# EAGLE design Qwiic_Adaptive_Switch_Input1.1 (EAGLE 9.6.2)
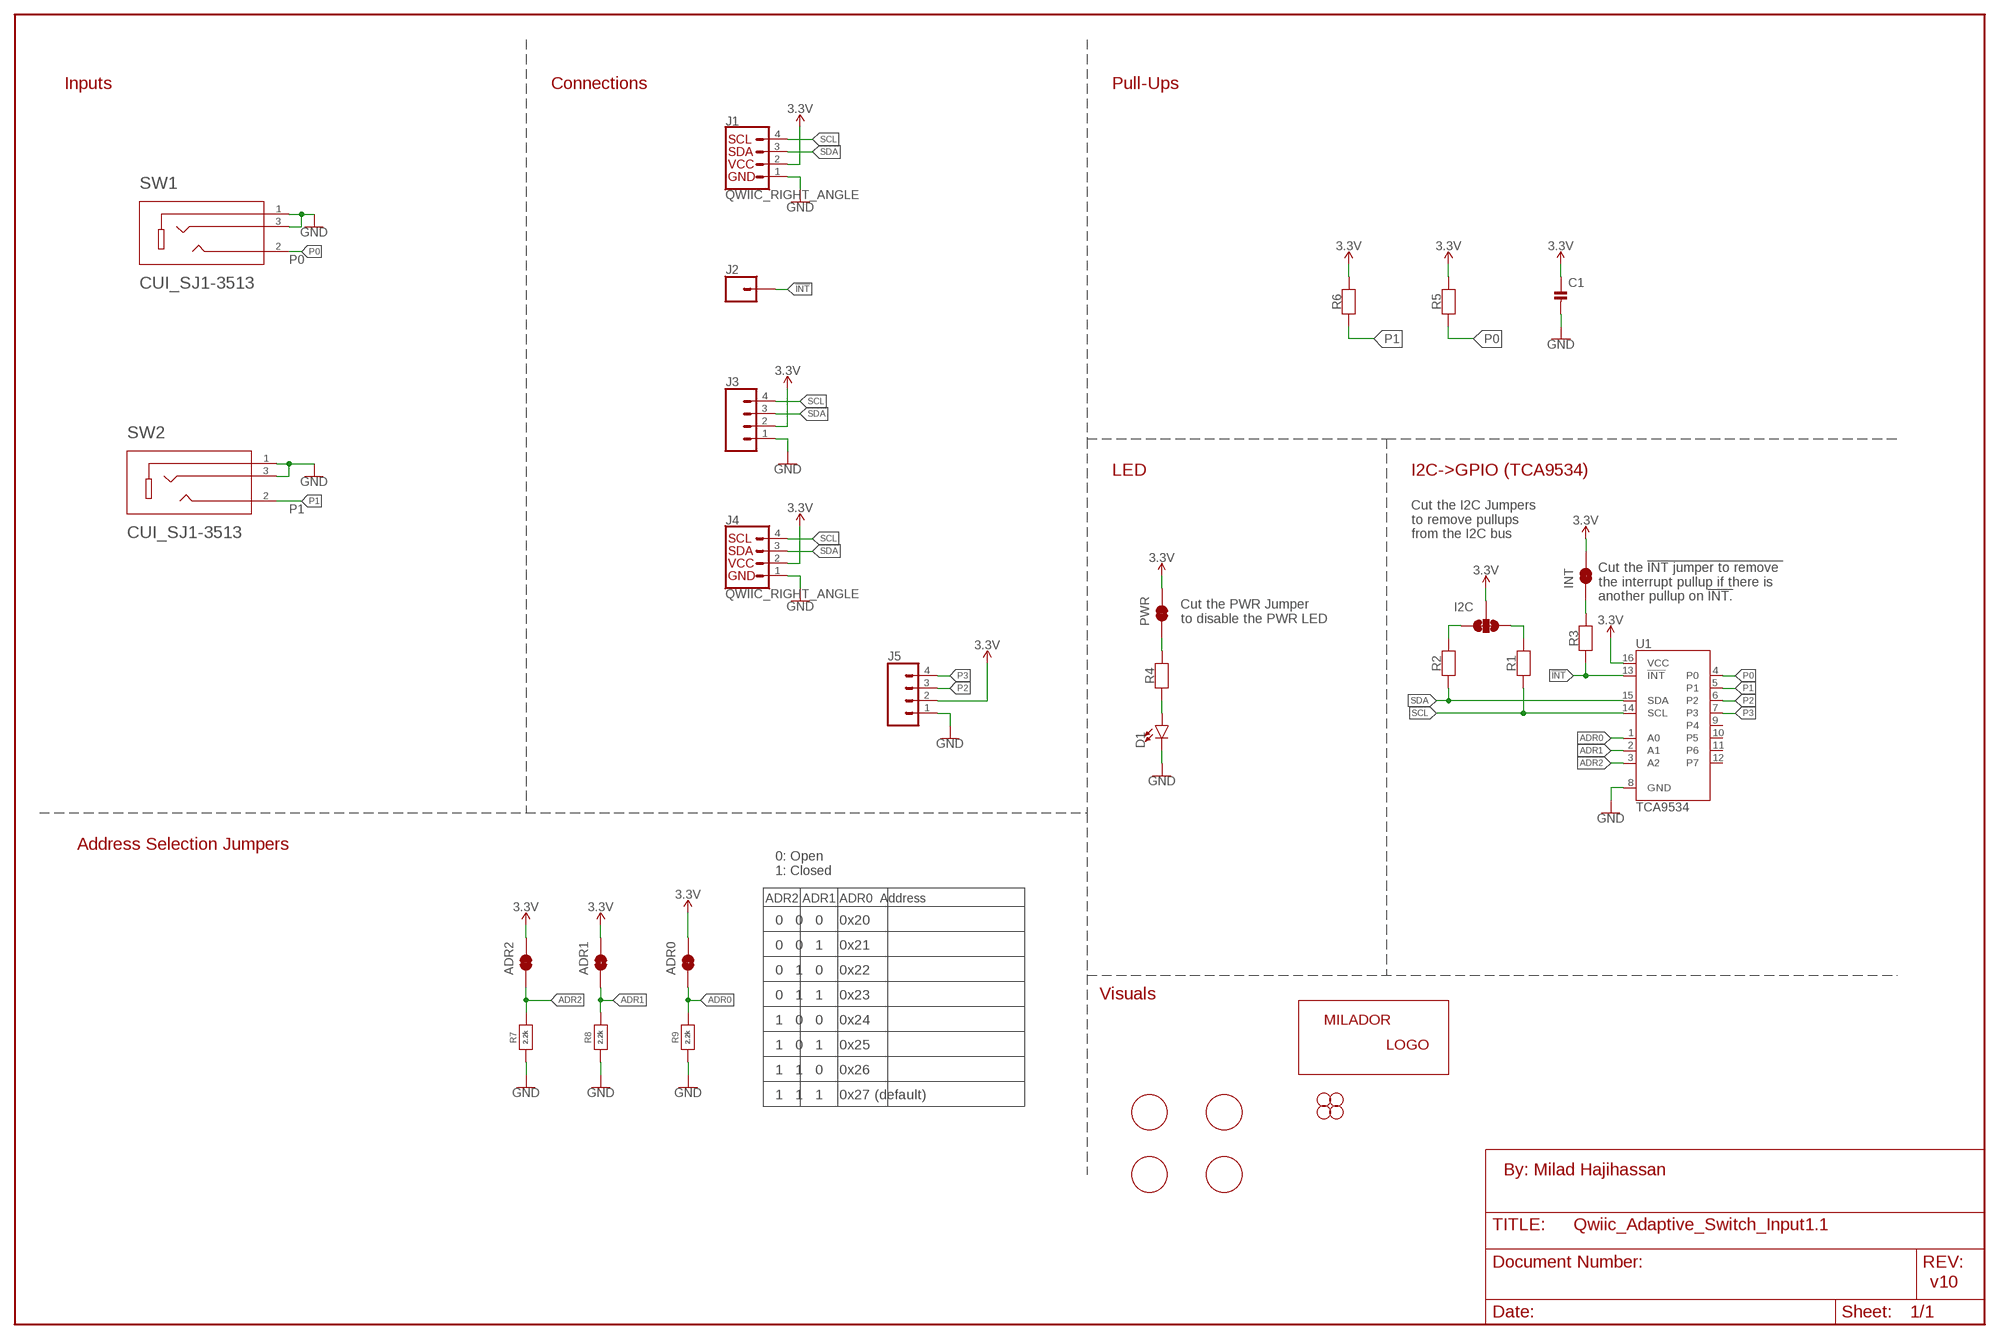
[diagram p0: schematic, sheet 1]

## Parts
ADR0  JUMPERS-SMT_2_NC_TRACE_SILK  [JUMPERS_SMT-JUMPER_2_NC_TRACE_SILK]
ADR1  JUMPERS-SMT_2_NC_TRACE_SILK  [JUMPERS_SMT-JUMPER_2_NC_TRACE_SILK]
ADR2  JUMPERS-SMT_2_NC_TRACE_SILK  [JUMPERS_SMT-JUMPER_2_NC_TRACE_SILK]
C1  0.1uF  CAP_CERAMIC-0805-MP  [0805-MP]
D1  RED  LED0805_NOOUTLINE  [CHIPLED_0805_NOOUTLINE]
H1  STAND-OFF-3.3  [STAND-OFF-3.3]
H2  STAND-OFF-3.3  [STAND-OFF-3.3]
I2C  JUMPERS_JUMPER-SMT_3_2-NC_TRACE_SILK  [JUMPERS_SMT-JUMPER_3_2-NC_TRACE_SILK]
INT  JUMPERS-SMT_2_NC_TRACE_SILK  [JUMPERS_SMT-JUMPER_2_NC_TRACE_SILK]
J1  QWIIC_RIGHT_ANGLE  QWIIC_CONNECTORSJS-1MM  [CONNECTORS_JST04_1MM_RA]
J2  CONNECTORS_CONN_01PTH_NO_SILK_YES_STOP  [CONNECTORS_1X01_NO_SILK]
J3  CONNECTORS_CONN_041X04_NO_SILK  [CONNECTORS_1X04_NO_SILK]
J4  QWIIC_RIGHT_ANGLE  QWIIC_CONNECTORSJS-1MM  [CONNECTORS_JST04_1MM_RA]
J5  CONNECTORS_CONN_041X04_NO_SILK  [CONNECTORS_1X04_NO_SILK]
JP3  STAND-OFF-3.3  [STAND-OFF-3.3]
JP4  STAND-OFF-3.3  [STAND-OFF-3.3]
LABEL_2  MILADOR-SWITCH-NAME-SW1  [SWITCH-SW1]
LABEL_3  MILADOR-SWITCH-NAME-SW2  [SWITCH-SW2]
LABEL_9  MILADOR-SWITCH-NAME-SW-INPUT  [SWITCH-INPUT]
LABEL_14  MILADOR-LOGO-  [MILADOR_LOGO1]
LABEL_18  MILADOR-SWITCH-NAME-SW-INPUT  [SWITCH-INPUT]
PWR  JUMPERS-SMT_2_NC_TRACE_SILK  [JUMPERS_SMT-JUMPER_2_NC_TRACE_SILK]
R1  2.2k  RESISTOR-0805-MP  [0805-MP]
R2  2.2k  RESISTOR-0805-MP  [0805-MP]
R3  10k  RESISTOR-0805-MP  [0805-MP]
R4  1k  RESISTOR-0805-MP  [0805-MP]
R5  4.7k  RESISTOR-0805-MP  [0805-MP]
R6  4.7K  RESISTOR-0805-MP  [0805-MP]
R7  2.2k  RESISTOR-0805-MP  [0805-MP]
R8  2.2k  RESISTOR-0805-MP  [0805-MP]
R9  2.2k  RESISTOR-0805-MP  [0805-MP]
SW1  CUI_SJ1-3513  [CUI_SJ1-3513]
SW2  CUI_SJ1-3513  [CUI_SJ1-3513]
U1  TCA9534  TCA9534U  [16SOIC]

## Nets
3.3V: ADR0.2 ADR1.2 ADR2.2 C1.1 I2C.2 INT.2 J1.2 J3.2 J4.2 J5.2 PWR.2 R5.2 R6.2 U1.16(VCC)
!INT: J2.1 R3.1 U1.13(!INT)
ADR0: ADR0.1 R9.2 U1.1(A0)
ADR1: ADR1.1 R8.2 U1.2(A1)
ADR2: ADR2.1 R7.2 U1.3(A2)
GND: C1.2 D1.C J1.1 J3.1 J4.1 J5.1 R7.1 R8.1 R9.1 SW1.1 SW1.3 SW2.1 SW2.3 U1.8(GND)
N$1: INT.1 R3.2
N$2: D1.A R4.1
N$3: PWR.1 R4.2
P0: R5.1 SW1.2 U1.4(P0)
P1: R6.1 SW2.2 U1.5(P1)
P2: J5.3 U1.6(P2)
P3: J5.4 U1.7(P3)
SCL: J1.4 J3.4 J4.4 R1.1 U1.14(SCL)
SCL_PU1: I2C.1 R2.2
SDA: J1.3 J3.3 J4.3 R2.1 U1.15(SDA)
SDA_PU1: I2C.3 R1.2
Unconnected: U1.9(P4) U1.10(P5) U1.11(P6) U1.12(P7)

## Notes on the sheet
- Inputs | Connections | Pull-Ups
- LED | I2C->GPIO (TCA9534)
- Cut the I2C Jumpers 
  to remove pullups 
  from the I2C bus
- Cut the !INT jumper to remove 
  the interrupt pullup if there is 
  another pullup on !INT.
- Cut the PWR Jumper
  to disable the PWR LED
- Address Selection Jumpers
- 0: Open
  1: Closed
- ADR2 ADR1 ADR0  Address
- 0   0   0    0x20
- 0   0   1    0x21
- 0   1   0    0x22
- 0   1   1    0x23 | Visuals
- 1   0   0    0x24
- 1   0   1    0x25
- 1   1   0    0x26
- 1   1   1    0x27 (default)
- By: Milad Hajihassan
- v10

## Library data of the parts
ADR0 ADR1 ADR2 INT PWR = milador_SMD:JUMPERS-SMT_2_NC_TRACE: Normally closed trace jumper This jumper has a trace between two pads so it's normally closed (NC). Use a razor knife to open the connection. For best results follow the IPC guidelines for cutting traces: Cutout at least 0.063 mm (0.005 in). Remove all loose material to clean up the cut area. Seal the cut with an approved epoxy. Reapply solder to reclose the connection.
C1 = milador_SMD:CAP_CERAMIC-: Ceramic Capacitors For new designs, use the packages preceded by an '_' character since they are more reliable: The following footprints should be used on most boards: _0402 - Standard footprint for regular board layouts _0603 - Standard footprint for regular board layouts _0805 - Standard footprint for regular board layouts _1206 - Standard footprint for regular board layouts For extremely tight-pitch boards where space is at a premium, the following 'micro-pitch' footprints can be used (smaller pads, no silkscreen outline, etc.): _0402MP - Micro-pitch footprint for very dense/compact boards _0603MP - Micro-pitch footprint for very dense/compact boards _0805MP - Micro-pitch footprint for very dense/compact boards _1206MP - Micro-pitch footprint for very dense/compact boards
D1 = milador_SMD:LED: LED 0603 - 0603 Surface Mount Package 2mA: Green LED - Low Power (3.9mcd, 2ma, 1.7Vf) - Digikey: 475-2709-2-ND Orange LED - Low Power (9.8mcd, 2ma, 1.8Vf) - Digikey: 475-1194-2-ND Red LED - Low Power (5mcd, 2ma, 1.8Vf) - Digikey: 475-1195-2-ND Yellow LED - Low Power (7mcd, 2ma, 1.8Vf) - Digikey: 475-1196-2-ND 5mA: Blue LED - Low Power (17mcd, 5ma, 2.9Vf) - Digikey: LNJ937W8CRACT-ND 0805 - 0805 Surface Mount Package 2mA: Red LED (8.8mcd, 2mA, 1.8Vf, Clear) - Low Power [Digikey: 475-2510-1-ND] Green LED (5mcd, 2mA, 1.8Vf, Clear) - Low Power [Digikey: 475-2730-1-ND] Yellow LED (11.3mcd, 2mA, 1.8Vf, Clear) - Low Power [Digikey: 475-2555-1-ND] 20mA: Red LED (104mcd, 20mA, Diffused) - LS R976 [Digikey: 475-1278-6-ND] Red LED (12mcd, 20mA, 2.0Vf, Clear) - APT2012EC [Digikey: 754-1128-1-ND] Green LED (15mcd, 20mA, 2.2Vf, Clear) - APT2012GC [Digikey: 754-1131-1-ND] Orange LED (160mcd, 20mA, 2.1Vf, Clear) - APT2012SECK [Digikey: 754-1130-1-ND] 1206 - 1206 Surface Mount Package Green LED (26mcd, 20mA, Diffused) - LG N971 [Digikey: 475-1407-6-ND] Red LED (15mcd, 20mA, Diffused) - LH N974 [Digikey: 475-1416-6-ND] Cree - Cree High-Power Surface Mount LEDs XPEBWT-L1-0000-00D50 - White 111lm 350mA 2.9Vf 6200K 110° XTEAWT-00-0000-00000LEE3 - White 114lm 350mA 2.85Vf 5000K 115° Everlight - Everlight 45-21 Series Surface Mount LEDs 45-21/QK2C-B2832AC2CB2/2T - Warm White 2000mcd 20mA 3.25Vf 3050K 120° 45-21/LK2C-B38452C4CB2/2T - Nuetral White 2000mcd 20mA 3.25Vf 4150K 120° 45-21/LK2C-B50634C6CB2/2T - Cold White 2200mcd 20mA 3.25Vf 5650K 120° PLCC2 Reverse Mount LS T77K-J1L2-1-0-2-R18-Z - Red 11.25mcd 2mA 1.8Vf 630nm 120° LO T77K-L1M2-24-Z - Orange 19.6mcd 2mA 1.8Vf 606nm 120° LY T77K-K2M1-26-Z - Yellow 15.7mcd 2mA 1.8Vf 587nm 120°
H1 H2 JP3 JP4 = milador:STAND-OFF-: Stand Off Drill holes for mechanically mounting via screws, standoffs, etc. Note: Use the keepout ring to avoid running the screw head into surrounding components. Variant Overviews STAND-OFF - Mechanical footprint for a #4 phillips button head screw. STAND-OFF-TIGHT - Mechanical footprint for a #4 phillips button head screw, Example SparkFun Products Screw - Phillips Head (1/4", 4-40, 10 pack) <https://www.sparkfun.com/products/10453> (PRT-10453) Screw - Phillips Head (1/2", 4-40, 10 pack) <https://www.sparkfun.com/products/10452> (PRT-10452) Screw - Phillips Head (3/4", 4-40, 10 pack) <https://www.sparkfun.com/products/10451> (PRT-10451) Screw - Phillips Head (1", 4-40, 10 pack) <https://www.sparkfun.com/products/10450> (PRT-10450)
I2C = milador_SMD:JUMPERS_JUMPER-SMT_3_2-NC_TRACE: Normally closed trace jumper (2 of 2 connections) This jumper has a trace between all three pads so they are normally closed (NC). Use a razor knife to open the connection(s). For best results follow the IPC guidelines for cutting traces: Cutout at least 0.063 mm (0.005 in). Remove all loose material to clean up the cut area. Seal the cut with an approved epoxy. Reapply solder to reclose the connection(s).
J1 J4 = milador_SMD:QWIIC_CONNECTORS: SparkFun I2C Standard Qwiic Connector An SMD 1mm pitch JST connector makes it easy and quick (get it? Qwiic?) to connect I2C devices to each other. The Qwiic system <http://www.sparkfun.com/qwiic> enables fast and solderless connection between popular platforms and various sensors and actuators. We carry 200mm <https://www.sparkfun.com/products/14204>, 100mm <https://www.sparkfun.com/products/14205>, 50mm <https://www.sparkfun.com/products/14206>, and breadboard friendly <https://www.sparkfun.com/products/14207> Qwiic cables. We also offer 10 pcs strips <https://www.sparkfun.com/products/14323> the SMD connectors.; PROD_ID: CONN-13694
J2 = milador:CONNECTORS_CONN_01: Single connection point. Often used as Generic Header-pin footprint for 0.1 inch spaced/style header connections On any of the 0.1 inch spaced packages, you can populate with these: Break Away Headers - Straight <https://www.sparkfun.com/products/116> (PRT-00116) Break Away Male Headers - Right Angle <https://www.sparkfun.com/products/553> (PRT-00553) Female Headers <https://www.sparkfun.com/products/115> (PRT-00115) Break Away Headers - Machine Pin <https://www.sparkfun.com/products/117> (PRT-00117) Break Away Female Headers - Swiss Machine Pin <https://www.sparkfun.com/products/743> (PRT-00743) This device is also useful as a general connection point to wire up your design to another part of your project. Our various solder wires solder well into these plated through hole pads. Hook-Up Wire - Assortment (Stranded, 22 AWG) <https://www.sparkfun.com/products/11375> (PRT-11375) Hook-Up Wire - Assortment (Solid Core, 22 AWG) <https://www.sparkfun.com/products/11367> (PRT-11367) View the entire wire category on our website here <https://www.sparkfun.com/categories/141> Special notes: SMTSO-256-ET is a "flush mount" nut for a 4-40 screw. We mostly use this on specialty testbeds; it is a nice way to connect hardware to your PCB at an adjustable hieght. Also note, the SNAP packages are for using a snappable style connector. We sell a baggie of snaps and they are also used on two LilyPad designs: Snap Assortment - 30 pack (male and female) <https://www.sparkfun.com/products/11347> (DEV-11347) LilyPad Arduino SimpleSnap <https://www.sparkfun.com/products/10941> (DEV-10941) LilyPad SimpleSnap Protoboard <https://www.sparkfun.com/products/10940> (DEV-10940)
J3 J5 = milador:CONNECTORS_CONN_04: Multi connection point. Often used as Generic Header-pin footprint for 0.1 inch spaced/style header connections On any of the 0.1 inch spaced packages, you can populate with these: Break Away Headers - Straight <https://www.sparkfun.com/products/116> (PRT-00116) Break Away Male Headers - Right Angle <https://www.sparkfun.com/products/553> (PRT-00553) Female Headers <https://www.sparkfun.com/products/115> (PRT-00115) Break Away Headers - Machine Pin <https://www.sparkfun.com/products/117> (PRT-00117) Break Away Female Headers - Swiss Machine Pin <https://www.sparkfun.com/products/743> (PRT-00743) For SCREWTERMINALS and SPRING TERMINALS visit here: Screw Terimnals on SparkFun.com <https://www.sparkfun.com/search/results?term=Screw+Terminals> (5mm/3.5mm/2.54mm spacing) This device is also useful as a general connection point to wire up your design to another part of your project. Our various solder wires solder well into these plated through hole pads. Hook-Up Wire - Assortment (Stranded, 22 AWG) <https://www.sparkfun.com/products/11375> (PRT-11375) Hook-Up Wire - Assortment (Solid Core, 22 AWG) <https://www.sparkfun.com/products/11367> (PRT-11367) View the entire wire category on our website here <https://www.sparkfun.com/categories/141> Special notes: Molex polarized connector foot print use with SKU : PRT-08231 with associated crimp pins and housings. 1MM SMD Version SKU: PRT-10208; PROD_ID: CONN-09696
LABEL_2 LABEL_3 LABEL_9 LABEL_18 = milador:MILADOR-SWITCH-NAME-
LABEL_14 = milador:MILADOR-LOGO-
R1-R9 = milador_SMD:RESISTOR-: Resistors For new designs, use the packages preceded by an '_' character since they are more reliable: The following footprints should be used on most boards: _0402 - Standard footprint for regular board layouts _0603 - Standard footprint for regular board layouts _0805 - Standard footprint for regular board layouts _1206 - Standard footprint for regular board layouts For extremely tight-pitch boards where space is at a premium, the following 'micro-pitch' footprints can be used (smaller pads, no silkscreen outline, etc.): _0402MP - Micro-pitch footprint for very dense/compact boards _0603MP - Micro-pitch footprint for very dense/compact boards _0805MP - Micro-pitch footprint for very dense/compact boards _1206MP - Micro-pitch footprint for very dense/compact boards
SW1 SW2 = MMC Eagle:CUI_SJ1-3513
U1 = milador_SMD:TCA9534: Texas Instruments TCA9534 I2C -> GPIO Expander This I2C -> GPIO Expander allows you to attach 8 GPIO to your I2C bus. With 8 different addresses, up to 64 GPIO are possible on one I2C bus; PROD_ID: IC-14889

## Board
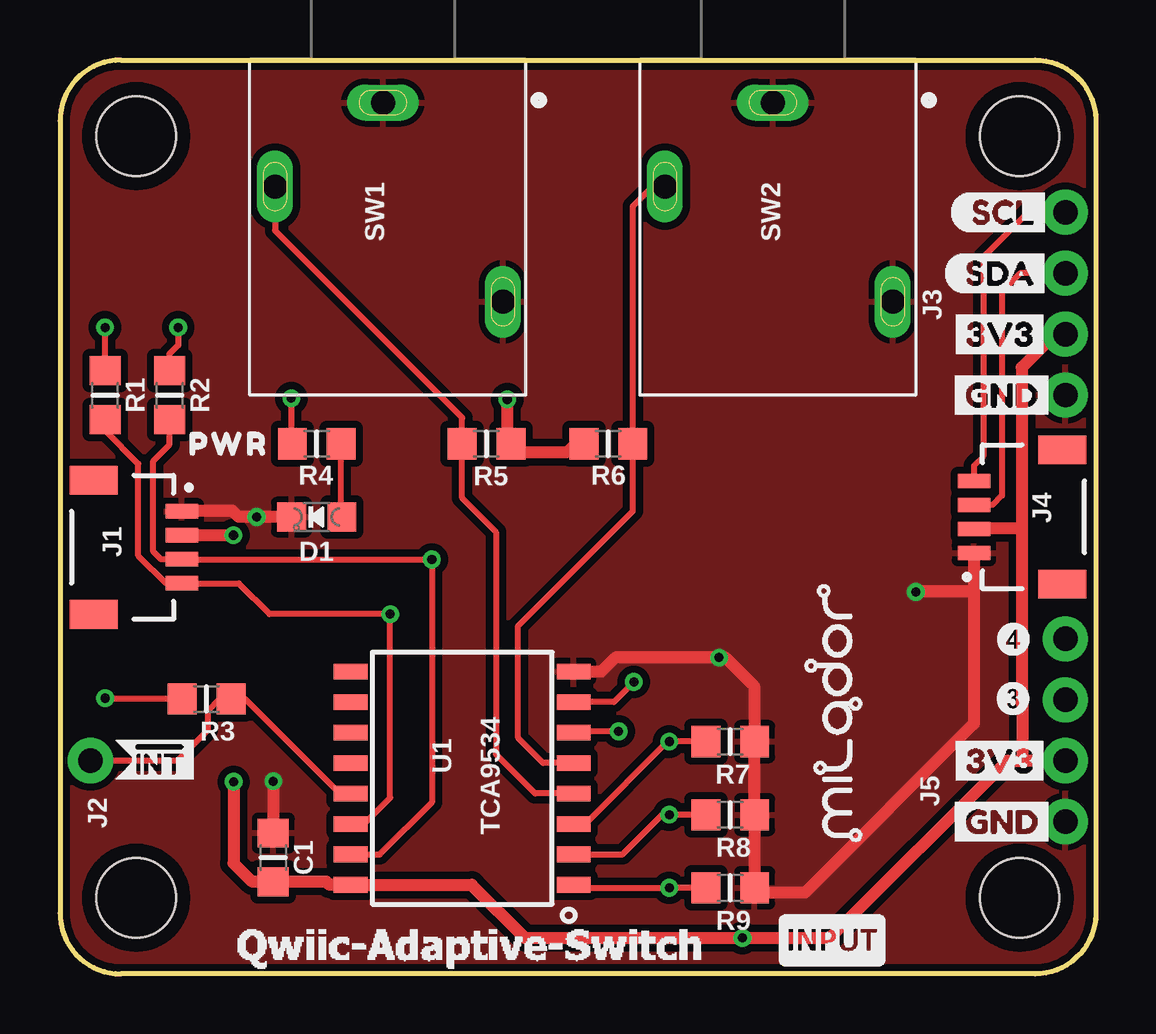
[diagram p1: board, top side]
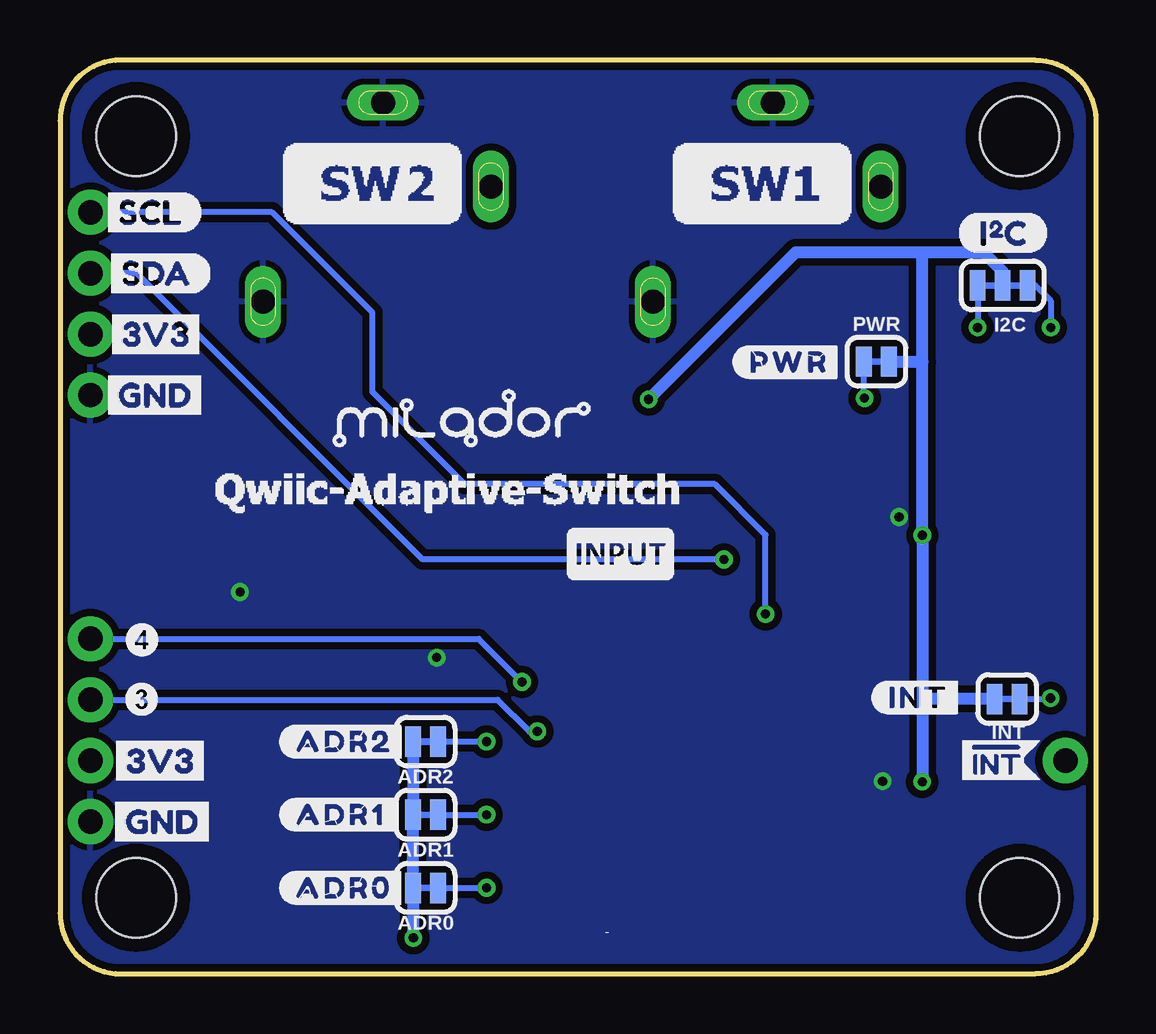
[diagram p2: board, bottom side, seen from below]

Size 43.18 x 38.1 mm. Coordinates in mm from the lower left corner, seen from the top.
Outline: 2.54,38.1 40.64,38.1 arc-90 43.18,35.56 43.18,2.54 arc-90 40.64,0 2.54,0 arc-90 0,2.54 0,35.56 arc-90 2.54,38.1
Copper layers (1*16): Top 0.035mm / dielectric 1.5mm / Bottom 0.035mm
Design rules "SparkFun-2-layer-TIGHT *": minimum track width 7mil, minimum drill 15mil, track to track 1mil, track to pad 1mil, pad to pad 1mil, via to via 1mil, smd to smd 1mil, copper to edge 7mil, drill to drill 7mil, minimum pad ring 7mil, minimum via ring 7mil, stop-mask expansion 4mil, vias tented up to drill 25mil, thermal gap 10mil

### Footprints (pad centres in the part's own frame; a part is rotated, then mirrored left to right if it is on the bottom)
JUMPERS_SMT-JUMPER_2_NC_TRACE_SILK = smd 0.66 x 1.27: 1 -0.521,0; 2 0.521,0
0805-MP = smd 1.2 x 1.3: 1 -1.016,0; 2 1.016,0
CHIPLED_0805_NOOUTLINE = smd 1.2 x 1.2: A 0,-1.05; C 0,1.05
STAND-OFF-3.3 = hole 3.302: 0,0
JUMPERS_SMT-JUMPER_3_2-NC_TRACE_SILK = smd 0.66 x 1.27: 1 -1.041,0; 2 0,0; 3 1.041,0
CONNECTORS_JST04_1MM_RA = smd 0.6 x 1.35: 1 -1.5,0; 2 -0.5,0; 3 0.5,0; 4 1.5,0 | smd 1.2 x 2: NC1 2.8,-3.675; NC2 -2.8,-3.675
CONNECTORS_1X01_NO_SILK = drill 1.016 pad 1.88: 1 0,0
CONNECTORS_1X04_NO_SILK = drill 1.016 pad 1.88: 1 0,0; 2 2.54,0; 3 5.08,0; 4 7.62,0
CUI_SJ1-3513 = drill 1 long: 1 0,0; 2 3.5,-4.5; 3 8.3,5
16SOIC = smd 1.397 x 0.648: 1 -4.65,4.445; 2 -4.65,3.175; 3 -4.65,1.905; 4 -4.65,0.635; 5 -4.65,-0.635; 6 -4.65,-1.905; 7 -4.65,-3.175; 8 -4.65,-4.445; 9 4.65,-4.445; 10 4.65,-3.175; 11 4.65,-1.905; 12 4.65,-0.635; 13 4.65,0.635; 14 4.65,1.905; 15 4.65,3.175; 16 4.65,4.445

### Placement (x,y rotation side)
ADR0  27.94,3.59 180 bottom
ADR1  27.94,6.64 180 bottom
ADR2  27.94,9.68 180 bottom
C1  8.89,4.86 90 top
D1  10.7,19.05 90 top
H1  40.01,34.92 0 top
H2  3.17,34.92 0 top
I2C  3.89,28.7 0 bottom
INT  3.7,11.46 180 bottom
J1  5.08,17.78 270 top
J2  1.27,8.89 270 top
J3  41.91,24.13 90 top
J4  38.1,19.05 90 top
J5  41.91,6.35 90 top
JP3  3.17,3.17 0 top
JP4  40.01,3.17 0 top
LABEL_1  [I2C]  5.77,30.89 0 bottom
LABEL_2  13.91,32.94 0 bottom
LABEL_3  30.16,32.94 0 bottom
LABEL_4  [#PWR#0]  15.14,25.5 0 bottom
LABEL_5  [PWR0]  4.67,22.1 0 top
LABEL_7  MILADOR-LOGO-  [MILADOR_LOGO1]  26.31,22 0 bottom
LABEL_8  [MILADOR_QWIIC_SWITCH]  27,20 0 bottom
LABEL_9  19.8,17.5 0 bottom
LABEL_10  [#INT#0]  9.35,11.52 0 bottom
LABEL_11  [#INT0]  6.25,8.91 0 bottom
LABEL_12  [#INT0]  2.05,8.93 0 top
LABEL_13  [MILADOR_QWIIC_SWITCH]  17.1,1 0 top
LABEL_14  33.4,11 90 top
LABEL_15  [#ADR2#0]  34.04,9.68 0 bottom
LABEL_16  [#ADR1#0]  34.04,6.64 0 bottom
LABEL_17  [#ADR0#0]  34.04,3.59 0 bottom
LABEL_18  32.2,1.4 0 top
LABEL_19  [SCL6]  37.08,31.75 0 top
LABEL_20  [SDA5]  36.83,29.21 0 top
LABEL_21  [3V33]  36.83,26.67 0 top
LABEL_22  [GND4]  36.83,24.13 0 top
LABEL_23  [3V33]  36.83,8.89 0 top
LABEL_24  [GND4]  36.83,6.35 0 top
LABEL_25  [SCL0]  41.66,31.75 0 bottom
LABEL_26  [SDA1]  41.53,29.21 0 bottom
LABEL_27  [3V33]  41.53,26.67 0 bottom
LABEL_28  [GND4]  41.66,24.13 0 bottom
LABEL_29  [3V33]  41.35,8.89 0 bottom
LABEL_30  [GND4]  41.35,6.35 0 bottom
PWR  9.15,25.53 0 bottom
R1  1.88,24.13 90 top
R2  4.57,24.13 90 top
R3  6.11,11.46 180 top
R4  10.7,22.1 180 top
R5  17.78,22.1 0 top
R6  22.86,22.1 180 top
R7  27.94,9.68 180 top
R8  27.94,6.64 180 top
R9  27.94,3.59 180 top
SW1  13.46,36.32 270 top
SW2  29.72,36.32 270 top
U1  16.76,8.16 180 top

### Tracks (layer width: path | path; a pad name or v marks a point on that pad's centre or on a via)
3.3V  (via drill 0.38)
  Top 0.178: 38.1,18.57 J4.2 | J1.2 | 40.09,18.57
  Top 0.508: 40.09,18.57 38.1,18.57 | 40.09,18.57 40.09,25.28 41.48,26.67 J3.2 | 40.09,18.57 40.09,11.3 40.13,11.34 40.13,8.89 | v7.23,18.29 J1.2 | v7.24,8.01 7.24,4.62 8.02,3.84 C1.1 11.1,3.84 11.22,3.71 U1.16 17.16,3.71 19.38,1.5 v28.45,1.5 32.1,1.5 39.49,8.89 40.13,8.89 | J5.2 40.13,8.89 | v18.64,23.95 18.64,22.25 R5.2 18.8,22.05 19.1,21.74 21.13,21.74 21.49,22.1 R6.2
  Bottom 0.178: ADR1.2 28.47,6.62 | 28.47,3.6 ADR0.2 | v7.23,8.01 v7.24,8.01
  Bottom 0.508: v28.45,1.5 28.45,3.58 28.47,3.6 28.47,6.62 | ADR2.2 ADR1.2 | 7.23,25.53 v7.23,18.29 7.23,11.45 | 7.23,25.53 7.23,30.07 | PWR.2 7.23,25.53 | I2C.2 3.89,29.29 4.67,30.07 7.23,30.07 | 7.23,30.07 12.52,30.07 v18.64,23.95 | 7.23,11.45 v7.23,8.01 | INT.2 7.22,11.46 7.23,11.45
!INT
  Top 0.254: J2.1 4.89,8.89 6.15,10.15 6.15,10.95 6.66,11.46 R3.1 7.72,11.46 11.66,7.53 U1.13
ADR0  (via drill 0.38)
  Top 0.254: U1.1 21.82,3.71 21.95,3.59 v25.4,3.59 R9.2
  Bottom 0.254: ADR0.1 v25.4,3.59
ADR1  (via drill 0.38)
  Top 0.254: U1.2 23.45,4.99 25.1,6.64 v25.4,6.64 R8.2
  Bottom 0.254: ADR1.1 v25.4,6.64
ADR2  (via drill 0.38)
  Top 0.254: U1.3 21.9,6.25 25.33,9.68 v25.4,9.68 R7.2
  Bottom 0.254: ADR2.1 v25.4,9.68
GND  (via drill 0.38)
  Top 0.508: U1.8 22.57,12.61 23.16,13.19 v27.48,13.19 27.73,13.19 28.94,11.98 28.94,9.7 R7.1 R8.1 R9.1 29.16,3.39 31.05,3.39 38.1,10.44 38.1,15.94 | 8.89,7.22 v8.89,8.03 C1.2 | J4.1 38.1,15.94 | J1.1 5.11,19.3 7.19,19.3 7.45,19.05 v8.2,19.05 D1.C | 38.1,15.94 35.69,15.94 v35.68,15.93
  pour Bottom (isolate 0.305): 0,38.1 43.18,38.1 43.18,0 0,0
  pour Top (isolate 0.305): 0,38.1 43.18,38.1 43.18,0 0,0
N$1  (via drill 0.38)
  Top 0.254: R3.2 1.93,11.46 v1.89,11.5
  Bottom 0.254: INT.1 1.93,11.46 v1.89,11.5
N$2
  Top 0.254: D1.A 11.7,19.1 11.7,21.91 11.74,21.95 11.74,22.07 R4.1
N$3  (via drill 0.38)
  Top 0.254: R4.2 9.64,22.1 v9.64,24
  Bottom 0.178: v9.64,24 9.68,24.04 | 9.68,25.53 PWR.1
  Bottom 0.254: 9.68,25.53 9.68,24.04
P0
  Top 0.254: U1.4 19.81,7.53 18.18,9.16 18.18,18.42 16.76,19.83 R5.1 16.76,23.16 16.78,23.18 8.96,30.99 SW1.2
P1
  Top 0.254: U1.5 20.14,8.79 19.1,9.84 19.1,14.51 23.88,19.29 R6.1 23.88,32 24.69,32.82 SW2.2
P2  (via drill 0.38)
  Top 0.178: U1.6 21.46,10.11
  Top 0.254: v23.29,10.11 21.46,10.11
  Bottom 0.254: v23.29,10.11 v23.29,10.1 23.61,10.1 24.94,11.43 J5.3
P3  (via drill 0.38)
  Top 0.254: U1.7 23.09,11.34 v23.92,12.17
  Bottom 0.254: J5.4 25.73,13.97 23.93,12.17 v23.92,12.17
SCL  (via drill 0.38)
  Top 0.254: J4.4 38.1,21.18 38.48,21.57 38.48,29.87 40.36,31.75 J3.4 | R1.1 1.88,22.66 3.27,21.27 3.27,17.43 4.42,16.28 J1.4 7.46,16.28 8.74,15 v13.77,15 | v13.77,15 | U1.14 12.68,6.25 13.77,7.35 v13.77,15
  Bottom 0.254: v13.77,15 13.77,18.3 15.88,20.42 26.31,20.42 30.15,24.26 30.15,27.56 34.34,31.75 J3.4
SCL_PU1  (via drill 0.38)
  Top 0.254: v4.93,26.95 4.93,26.21 4.57,25.86 R2.2
  Bottom 0.254: I2C.1 v4.93,26.95
SDA  (via drill 0.38)
  Top 0.178: J4.3
  Top 0.254: J3.3 40.03,29.21 39.27,28.45 39.27,19.94 38.88,19.55 J4.3 | U1.15 13.33,4.99 15.5,7.16 v15.5,17.28 J1.3 4.21,17.28 3.89,17.6 3.89,21.39 4.57,22.07 R2.1
  Bottom 0.254: J3.3 39.99,29.21 28.06,17.28 v15.5,17.28
SDA_PU1  (via drill 0.38)
  Top 0.254: R1.2 v1.88,26.95
  Bottom 0.254: v1.88,26.95 1.88,28.06 2.52,28.7 I2C.3